# EAGLE design hc-cnc-pendant-2020 (EAGLE 9.5.2)
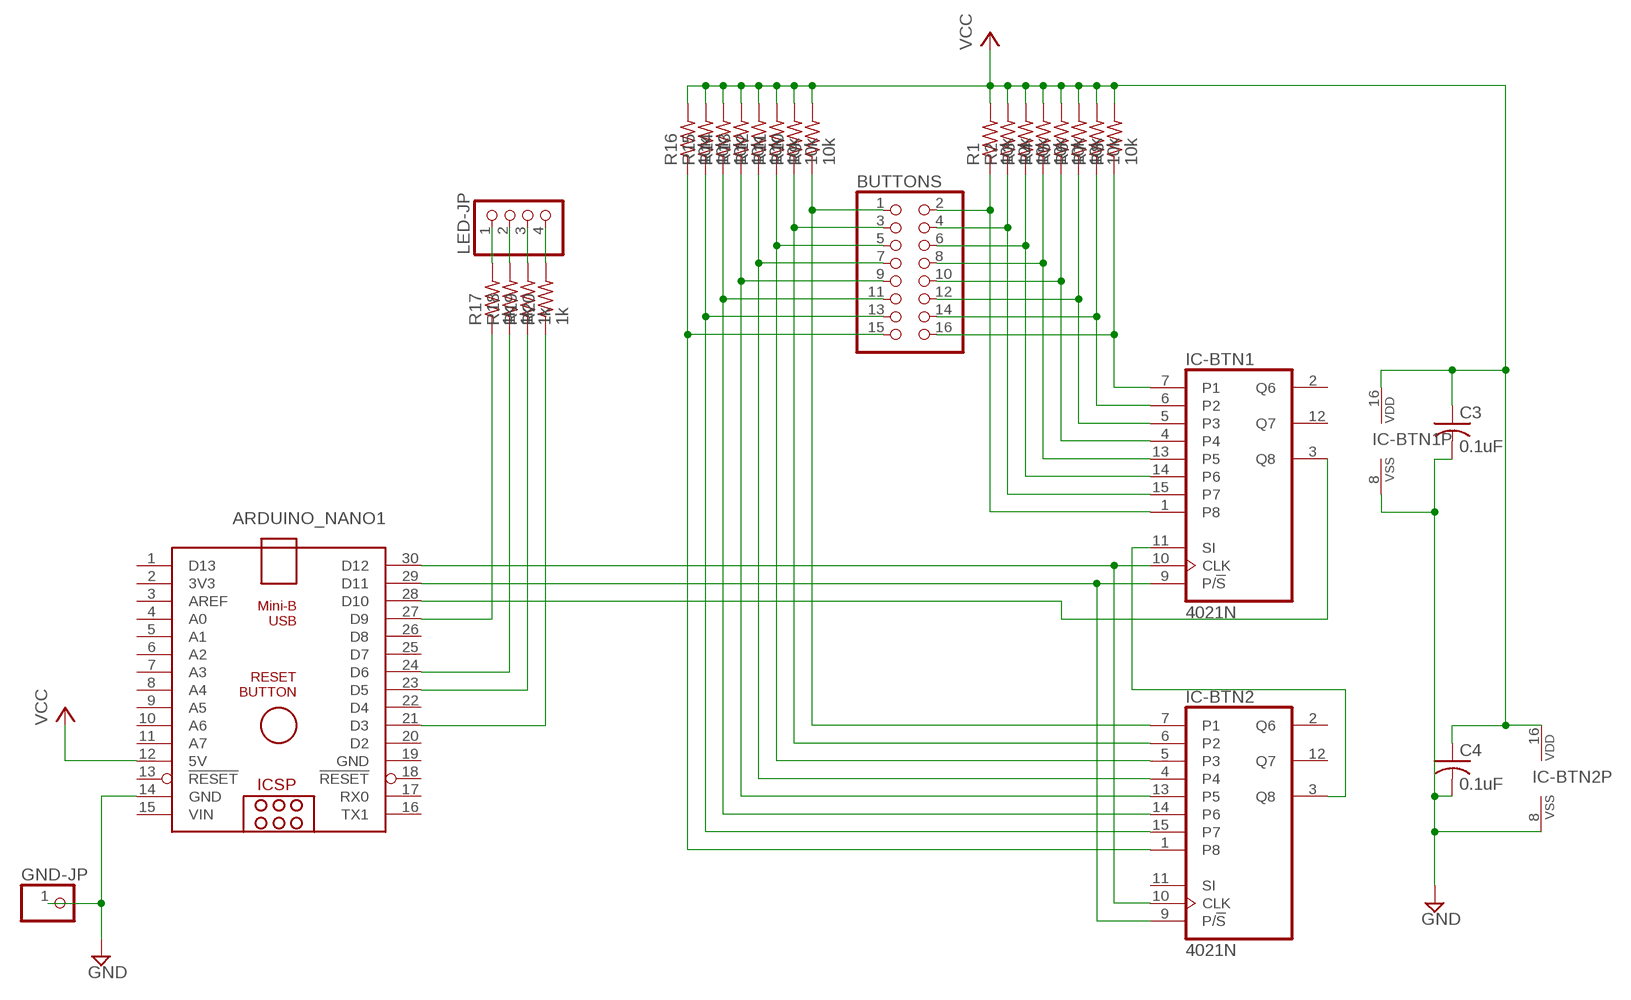
[diagram p0: schematic, sheet 1]

## Parts
ARDUINO_NANO1  ARDUINO_NANO_HCARDUINO_NANO_NO_HOLE  [ARDUINO_NANO_NO_HOLE]
BUTTONS  PINHD-2X8  [2X08]
C3  0.1uF  C-US025-030X050  [C025-030X050]
C4  0.1uF  C-US025-030X050  [C025-030X050]
GND-JP  PINHD-1X1  [1X01]
IC-BTN1  4021N  [DIL16]
IC-BTN2  4021N  [DIL16]
LED-JP  PINHD-1X4  [1X04]
R1  10k  R-US_0309/12  [0309/12]
R2  10k  R-US_0309/12  [0309/12]
R3  10k  R-US_0309/12  [0309/12]
R4  10k  R-US_0309/12  [0309/12]
R5  10k  R-US_0309/12  [0309/12]
R6  10k  R-US_0309/12  [0309/12]
R7  10k  R-US_0309/12  [0309/12]
R8  10k  R-US_0309/12  [0309/12]
R9  10k  R-US_0309/12  [0309/12]
R10  10k  R-US_0309/12  [0309/12]
R11  10k  R-US_0309/12  [0309/12]
R12  10k  R-US_0309/12  [0309/12]
R13  10k  R-US_0309/12  [0309/12]
R14  10k  R-US_0309/12  [0309/12]
R15  10k  R-US_0309/12  [0309/12]
R16  10k  R-US_0309/12  [0309/12]
R17  1k  R-US_0309/12  [0309/12]
R18  1k  R-US_0309/12  [0309/12]
R19  1k  R-US_0309/12  [0309/12]
R20  1k  R-US_0309/12  [0309/12]

## Nets
GND: ARDUINO_NANO1.14(GND) C3.2 C4.2 GND-JP.1 IC-BTN1.8(VSS) IC-BTN2.8(VSS)
N$1: ARDUINO_NANO1.30(D12) IC-BTN1.10(CLK) IC-BTN2.10(CLK)
N$2: ARDUINO_NANO1.29(D11) IC-BTN1.9(P/!S) IC-BTN2.9(P/!S)
N$3: BUTTONS.1 IC-BTN2.7(P1) R9.1
N$4: IC-BTN1.11(SI) IC-BTN2.3(Q8)
N$5: ARDUINO_NANO1.28(D10) IC-BTN1.3(Q8)
N$6: BUTTONS.3 IC-BTN2.6(P2) R10.1
N$7: BUTTONS.5 IC-BTN2.5(P3) R11.1
N$8: BUTTONS.7 IC-BTN2.4 R12.1
N$9: BUTTONS.9 IC-BTN2.13(P5) R13.1
N$10: BUTTONS.11 IC-BTN2.14(P6) R14.1
N$11: BUTTONS.13 IC-BTN2.15(P7) R15.1
N$12: BUTTONS.15 IC-BTN2.1(P8) R16.1
N$13: BUTTONS.2 IC-BTN1.1(P8) R1.1
N$14: BUTTONS.4 IC-BTN1.15(P7) R2.1
N$15: BUTTONS.6 IC-BTN1.14(P6) R3.1
N$16: BUTTONS.8 IC-BTN1.13(P5) R4.1
N$17: BUTTONS.10 IC-BTN1.4 R5.1
N$18: BUTTONS.12 IC-BTN1.5(P3) R6.1
N$19: BUTTONS.14 IC-BTN1.6(P2) R7.1
N$20: BUTTONS.16 IC-BTN1.7(P1) R8.1
N$21: LED-JP.1 R17.2
N$22: LED-JP.2 R18.2
N$23: LED-JP.3 R19.2
N$24: LED-JP.4 R20.2
N$25: ARDUINO_NANO1.21(D3) R20.1
N$26: ARDUINO_NANO1.23(D5) R19.1
N$27: ARDUINO_NANO1.24(D6) R18.1
N$28: ARDUINO_NANO1.27(D9) R17.1
VCC: ARDUINO_NANO1.12(5V) C3.1 C4.1 IC-BTN1.16(VDD) IC-BTN2.16(VDD) R1.2 R2.2 R3.2 R4.2 R5.2 R6.2 R7.2 R8.2 R9.2 R10.2 R11.2 R12.2 R13.2 R14.2 R15.2 R16.2
Unconnected: ARDUINO_NANO1.1(D13) ARDUINO_NANO1.2(3V3) ARDUINO_NANO1.3(AREF) ARDUINO_NANO1.4(A0) ARDUINO_NANO1.5(A1) ARDUINO_NANO1.6(A2) ARDUINO_NANO1.7(A3) ARDUINO_NANO1.8(A4) ARDUINO_NANO1.9(A5) ARDUINO_NANO1.10(A6) ARDUINO_NANO1.11(A7) ARDUINO_NANO1.13(!RESET) ARDUINO_NANO1.16(TX1) ARDUINO_NANO1.17(RX0) ARDUINO_NANO1.18(!RESET) ARDUINO_NANO1.20(D2) ARDUINO_NANO1.22(D4) ARDUINO_NANO1.25(D7) ARDUINO_NANO1.26(D8) IC-BTN1.2(Q6) IC-BTN1.12(Q7) IC-BTN2.2(Q6) IC-BTN2.11(SI) IC-BTN2.12(Q7)

## Power pins joined to a net without a drawn wire
GND: ARDUINO_NANO1.19(GND)
VIN: ARDUINO_NANO1.15(VIN)

## Library data of the parts
ARDUINO_NANO1 = ArduinoNano_HC:ARDUINO_NANO_HC: Arduino Nano HC Overview: The Arduino Nano is a small, complete, and breadboard-friendly board based on the ATmega328 (Arduino Nano 3.x) or ATmega168 (Arduino Nano 2.x). It has more or less the same functionality of the Arduino Duemilanove, but in a different package. It lacks only a DC power jack, and works with a Mini-B USB cable instead of a standard one. The Nano was designed and is being produced by Gravitech. Specifications: Microcontroller Atmel ATmega168 or ATmega328 Operating Voltage (logic level) 5 V Input Voltage (recommended) 7-12 V Input Voltage (limits) 6-20 V Digital I/O Pins 14 (of which 6 provide PWM output) Analog Input Pins 8 DC Current per I/O Pin 40 mA Flash Memory 16 KB (ATmega168) or 32 KB (ATmega328) of which 2 KB used by bootloader SRAM 1 KB (ATmega168) or 2 KB (ATmega328) EEPROM 512 bytes (ATmega168) or 1 KB (ATmega328) Clock Speed 16 MHz Dimensions 0.73" x 1.70" Length 45 mm Width 18 mm Weigth 5 g Power: The Arduino Nano can be powered via the Mini-B USB connection, 6-20V unregulated external power supply (pin 30), or 5V regulated external power supply (pin 27). The power source is automatically selected to the highest voltage source. Memory: The ATmega168 has 16 KB of flash memory for storing code (of which 2 KB is used for the bootloader); the ATmega328 has 32 KB, (also with 2 KB used for the bootloader). The ATmega168 has 1 KB of SRAM and 512 bytes of EEPROM (which can be read and written with the EEPROM library); the ATmega328 has 2 KB of SRAM and 1 KB of EEPROM. Input and Output: Each of the 14 digital pins on the Nano can be used as an input or output, using pinMode(), digitalWrite(), and digitalRead() functions. They operate at 5 volts. Each pin can provide or receive a maximum of 40 mA and has an internal pull-up resistor (disconnected by default) of 20-50 kOhms. In addition, some pins have specialized functions. Visit Arduino - ArduinoBoardNano <https://www.arduino.cc/en/Main/ArduinoBoardNano>
BUTTONS = pinhead:PINHD-2X8: PIN HEADER
C3 C4 = akstudios-adafruit:C-US: CAPACITOR, American symbol
GND-JP = pinhead:PINHD-1X1: PIN HEADER
IC-BTN1 IC-BTN2 = 40xx:4021: 8-bit static SHIFT REGISTER
LED-JP = pinhead:PINHD-1X4: PIN HEADER
R1-R20 = akstudios-adafruit:R-US_: RESISTOR, American symbol

## Board
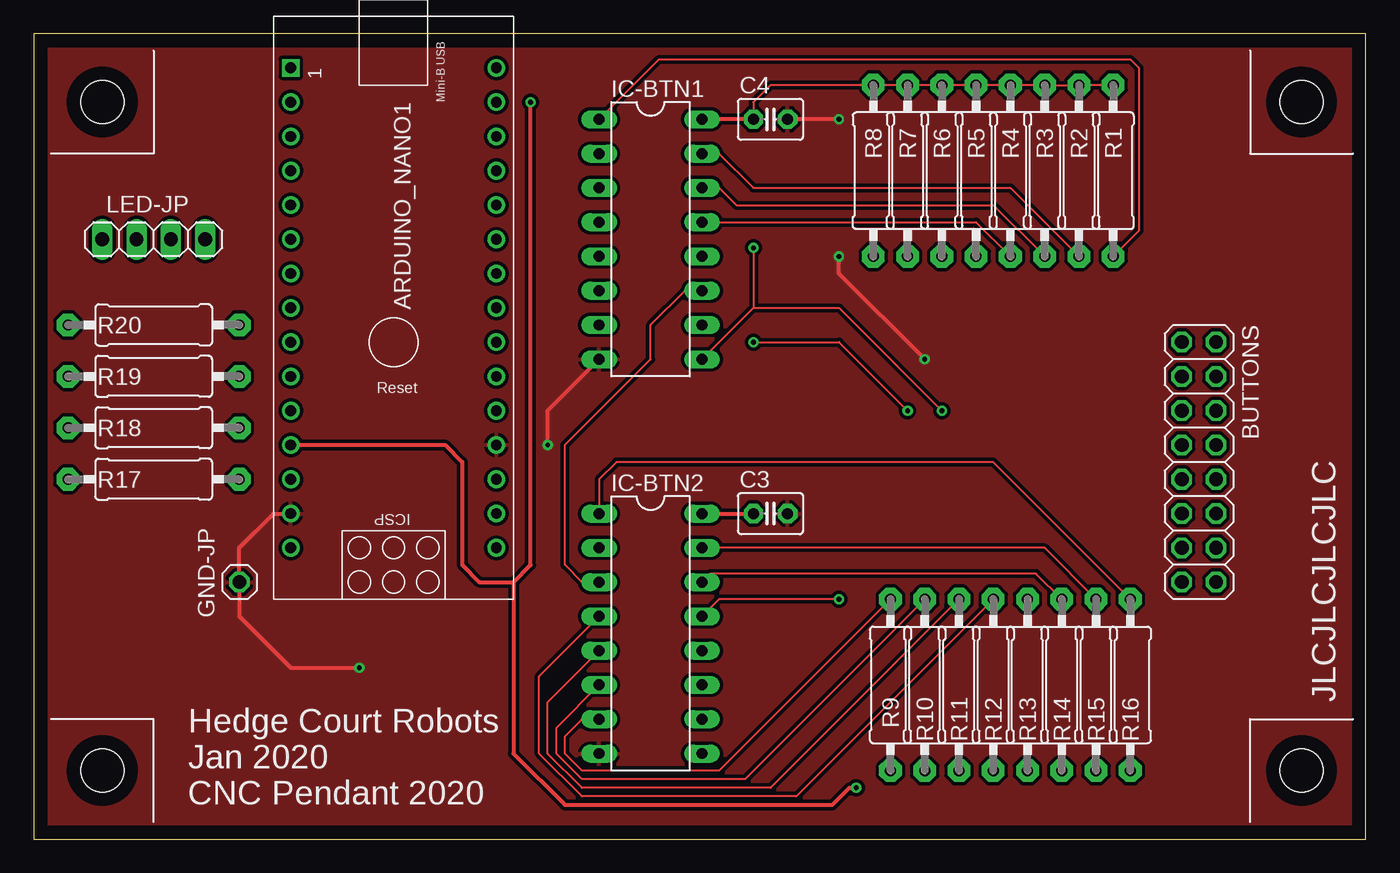
[diagram p1: board, top side]
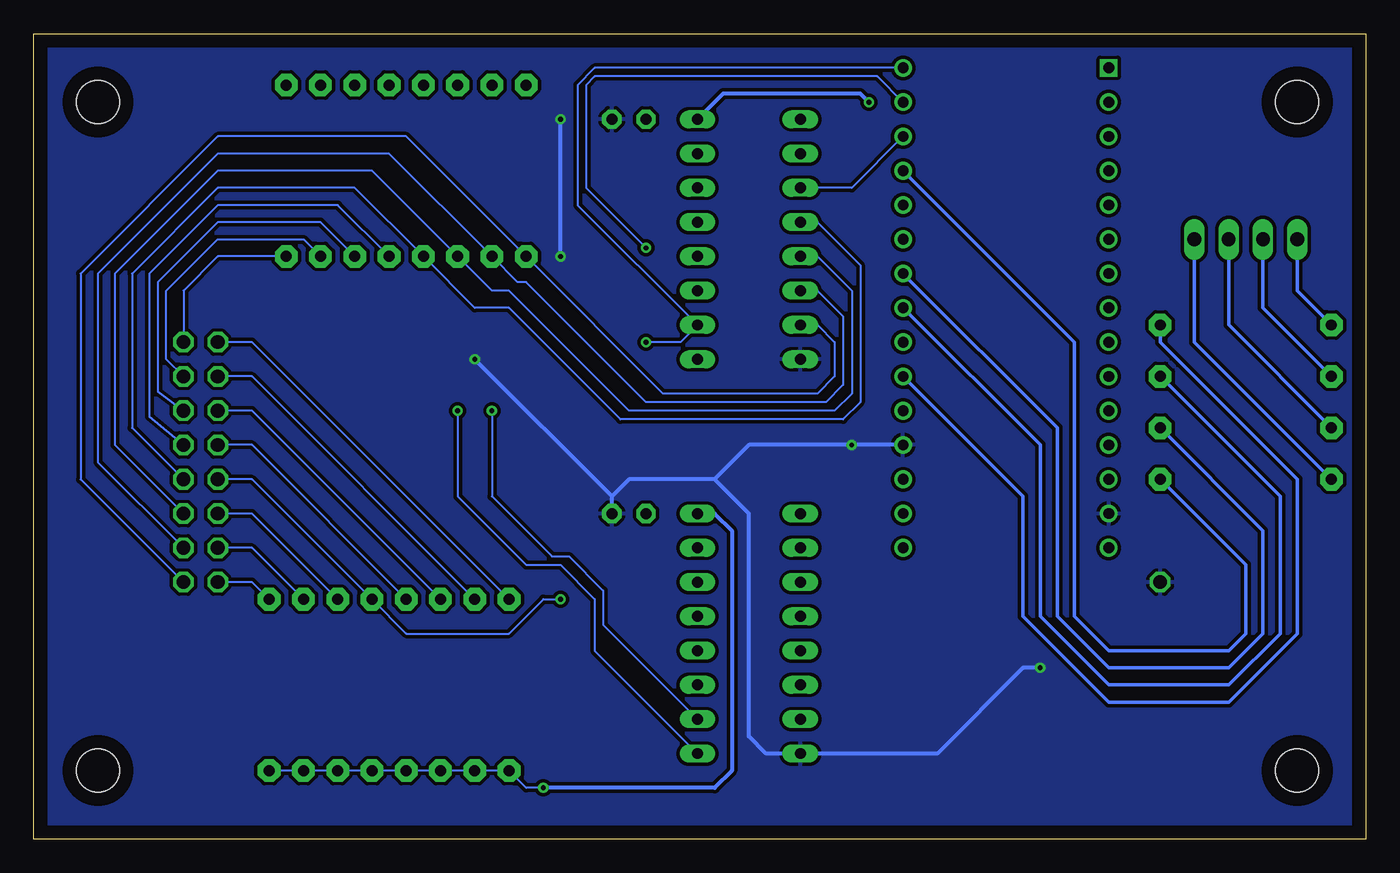
[diagram p2: board, bottom side, seen from below]

Size 98.73 x 59.68 mm. Coordinates in mm from the lower left corner, seen from the top.
Outline: 0,0 98.73,0 98.73,59.68 0,59.68 0,0
Copper layers (1*16): Top 0.035mm / dielectric 1.5mm / Bottom 0.035mm
Design rules "default": minimum track width 6mil, minimum drill 0.35mm, track to track 6mil, track to pad 6mil, pad to pad 6mil, via to via 6mil, smd to smd 6mil, copper to edge 40mil, drill to drill 6mil, minimum pad ring 10mil, minimum via ring 8mil, stop-mask expansion 4mil, vias tented up to drill 0mil, thermal gap 10mil
Holes 3.2 mm at 5.08,54.61 5.08,5.08 93.98,5.08 93.98,54.61

### Footprints (pad centres in the part's own frame; a part is rotated, then mirrored left to right if it is on the bottom)
ARDUINO_NANO_NO_HOLE = drill 0.8 square: 1 -20.32,-7.62 | drill 0.8: 2 -17.78,-7.62; 3 -15.24,-7.62; 4 -12.7,-7.62; 5 -10.16,-7.62; 6 -7.62,-7.62; 7 -5.08,-7.62; 8 -2.54,-7.62; 9 0,-7.62; 10 2.54,-7.62; 11 5.08,-7.62; 12 7.62,-7.62; 13 10.16,-7.62; 14 12.7,-7.62; 15 15.24,-7.62; 16 15.24,7.62; 17 12.7,7.62; 18 10.16,7.62; 19 7.62,7.62; 20 5.08,7.62; 21 2.54,7.62; 22 0,7.62; 23 -2.54,7.62; 24 -5.08,7.62; 25 -7.62,7.62; 26 -10.16,7.62; 27 -12.7,7.62; 28 -15.24,7.62; 29 -17.78,7.62; 30 -20.32,7.62
2X08 = drill 1.016 octagon: 1 -8.89,-1.27; 2 -8.89,1.27; 3 -6.35,-1.27; 4 -6.35,1.27; 5 -3.81,-1.27; 6 -3.81,1.27; 7 -1.27,-1.27; 8 -1.27,1.27; 9 1.27,-1.27; 10 1.27,1.27; 11 3.81,-1.27; 12 3.81,1.27; 13 6.35,-1.27; 14 6.35,1.27; 15 8.89,-1.27; 16 8.89,1.27
C025-030X050 = drill 0.813 pad 1.422 octagon: 1 -1.27,0; 2 1.27,0
1X01 = drill 1.016 octagon: 1 0,0
DIL16 = drill 0.813 long: 1 -8.89,-3.81; 2 -6.35,-3.81; 3 -3.81,-3.81; 4 -1.27,-3.81; 5 1.27,-3.81; 6 3.81,-3.81; 7 6.35,-3.81; 8 8.89,-3.81; 9 8.89,3.81; 10 6.35,3.81; 11 3.81,3.81; 12 1.27,3.81; 13 -1.27,3.81; 14 -3.81,3.81; 15 -6.35,3.81; 16 -8.89,3.81
1X04 = drill 1.016 long: 1 -3.81,0; 2 -1.27,0; 3 1.27,0; 4 3.81,0
0309/12 = drill 0.813 pad 1.676 octagon: 1 -6.35,0; 2 6.35,0

### Placement (x,y rotation side)
ARDUINO_NANO1  26.67,36.83 270 top
BUTTONS  86.36,27.94 270 top
C3  54.61,24.13 0 top
C4  54.61,53.34 0 top
GND-JP  15.24,19.05 0 top
IC-BTN1  45.72,44.45 270 top
IC-BTN2  45.72,15.24 270 top
LED-JP  8.89,44.45 180 top
R1  80.01,49.53 90 top
R2  77.47,49.53 90 top
R3  74.93,49.53 90 top
R4  72.39,49.53 90 top
R5  69.85,49.53 90 top
R6  67.31,49.53 90 top
R7  64.77,49.53 90 top
R8  62.23,49.53 90 top
R9  63.5,11.43 270 top
R10  66.04,11.43 270 top
R11  68.58,11.43 270 top
R12  71.12,11.43 270 top
R13  73.66,11.43 270 top
R14  76.2,11.43 270 top
R15  78.74,11.43 270 top
R16  81.28,11.43 270 top
R17  8.89,26.67 180 top
R18  8.89,30.48 180 top
R19  8.89,34.29 180 top
R20  8.89,38.1 180 top

### Tracks (layer width: path | path; a pad name or v marks a point on that pad's centre or on a via)
GND  (via drill 0.35)
  Top 0.305: ARDUINO_NANO1.14 17.78,24.13 15.24,21.59 GND-JP.1 15.24,16.51 19.05,12.7 v24.13,12.7 | v38.1,29.21 38.1,31.75 IC-BTN1.8 | v66.04,35.56 59.69,41.91 v59.69,43.18 | v59.69,53.34 C4.2
  Bottom 0.305: v24.13,12.7 25.4,12.7 31.75,6.35 IC-BTN2.8 44.45,6.35 45.72,7.62 45.72,24.13 48.26,26.67 | 55.88,25.4 54.61,26.67 48.26,26.67 | C3.2 55.88,25.4 | ARDUINO_NANO1.19 v38.1,29.21 45.72,29.21 48.26,26.67 | 55.88,25.4 v66.04,35.56 | v59.69,43.18 v59.69,53.34
  pour Top (isolate 0.254): 0,0 99.06,0 99.06,59.69 0,59.69
  pour Bottom (isolate 0.254): 0,0 99.06,0 99.06,59.69 0,59.69
N$1  (via drill 0.35)
  Top 0.152: v53.34,36.83 59.69,36.83 v64.77,31.75
  Bottom 0.152: ARDUINO_NANO1.30 57.15,57.15 58.42,55.88 58.42,46.99 IC-BTN1.10 50.8,36.83 v53.34,36.83 | v64.77,31.75 64.77,25.4 60.33,20.95 59.05,20.95 56.52,18.41 56.52,15.88 IC-BTN2.10
N$2  (via drill 0.35)
  Top 0.152: v53.34,43.81 53.34,39.37 | IC-BTN1.9 53.34,39.37 | 53.34,39.37 59.69,39.37 v67.31,31.75
  Bottom 0.152: ARDUINO_NANO1.29 36.2,56.52 57.15,56.52 57.78,55.88 57.78,48.26 v53.34,43.81 | v67.31,31.75 67.31,25.4 62.23,20.32 59.69,20.32 57.15,17.78 57.15,13.97 IC-BTN2.9
N$3
  Top 0.152: R9.1 50.8,5.08 40.64,5.08 39.37,6.35 39.37,7.62 40.64,8.89 IC-BTN2.7
  Bottom 0.152: R9.1 82.55,36.83 BUTTONS.1
N$4
  Top 0.152: IC-BTN2.3 40.64,19.05 39.37,20.32 39.37,29.21 45.72,35.56 45.72,38.1 48.26,40.64 IC-BTN1.11
N$5
  Bottom 0.152: ARDUINO_NANO1.28 38.1,48.26 IC-BTN1.3
N$6
  Top 0.152: R10.1 52.7,4.45 40.64,4.45 38.73,6.35 38.73,8.26 IC-BTN2.6
  Bottom 0.152: R10.1 82.55,34.29 BUTTONS.3
N$7
  Top 0.152: R11.1 54.61,3.81 40.64,3.81 38.1,6.35 38.1,10.16 IC-BTN2.5
  Bottom 0.152: R11.1 82.55,31.75 BUTTONS.5
N$8
  Top 0.152: R12.1 56.52,3.17 40.64,3.17 37.47,6.35 37.47,12.06 IC-BTN2.4
  Bottom 0.152: R12.1 82.55,29.21 BUTTONS.7
N$9  (via drill 0.35)
  Top 0.152: v59.69,17.78 50.8,17.78 IC-BTN2.13
  Bottom 0.152: BUTTONS.9 82.55,26.67 R13.1 71.12,15.24 63.5,15.24 60.96,17.78 v59.69,17.78
N$10
  Top 0.152: R14.1 74.3,19.68 50.16,19.68 IC-BTN2.14
  Bottom 0.152: R14.1 82.55,24.13 BUTTONS.11
N$11
  Top 0.152: R15.1 74.93,21.59 IC-BTN2.15
  Bottom 0.152: R15.1 82.55,21.59 BUTTONS.13
N$12
  Top 0.152: R16.1 71.12,27.94 43.18,27.94 41.91,26.67 IC-BTN2.1
  Bottom 0.152: R16.1 82.55,19.05 BUTTONS.15
N$13
  Top 0.152: R1.1 81.92,45.09 81.92,57.15 81.28,57.78 46.35,57.78 IC-BTN1.1
  Bottom 0.152: R1.1 85.09,43.18 87.63,40.64 BUTTONS.2
N$14
  Top 0.152: IC-BTN1.15 50.8,50.8 53.34,48.26 72.39,48.26 R2.1
  Bottom 0.152: R2.1 78.74,44.45 85.09,44.45 88.9,40.64 88.9,35.56 BUTTONS.4
N$15
  Top 0.152: IC-BTN1.14 50.8,48.26 52.07,46.99 71.12,46.99 R3.1
  Bottom 0.152: R3.1 77.47,45.72 85.09,45.72 89.53,41.27 89.53,33.18 BUTTONS.6
N$16
  Top 0.152: IC-BTN1.13 69.85,45.72 R4.1
  Bottom 0.152: R4.1 76.2,46.99 85.09,46.99 90.17,41.91 90.17,31.33 BUTTONS.8
N$17
  Bottom 0.152: BUTTONS.10 91.44,30.48 91.44,41.91 85.09,48.26 74.93,48.26 R5.1 66.04,39.37 63.5,39.37 55.24,31.11 38.73,31.11 37.47,32.38 37.47,42.55 40.64,45.72 IC-BTN1.4
N$18
  Bottom 0.152: BUTTONS.12 92.71,29.21 92.71,41.91 85.09,49.53 73.66,49.53 R6.1 64.77,40.64 63.5,40.64 54.61,31.75 39.37,31.75 38.1,33.02 38.1,40.64 40.64,43.18 IC-BTN1.5
N$19
  Bottom 0.152: BUTTONS.14 93.98,27.94 93.98,41.91 85.09,50.8 72.39,50.8 R7.1 62.87,41.27 62.23,41.27 53.34,32.38 40.01,32.38 38.73,33.66 38.73,38.73 40.64,40.64 IC-BTN1.6
N$20
  Bottom 0.152: BUTTONS.16 95.25,26.67 95.25,41.91 85.09,52.07 71.12,52.07 R8.1 52.07,33.02 40.64,33.02 39.37,34.29 39.37,36.83 40.64,38.1 IC-BTN1.7
N$21
  Bottom 0.254: R17.2 12.7,36.83 LED-JP.1
N$22
  Bottom 0.254: R18.2 10.16,38.1 LED-JP.2
N$23
  Bottom 0.254: R19.2 7.62,39.37 LED-JP.3
N$24
  Bottom 0.254: R20.2 5.08,40.64 LED-JP.4
N$25
  Bottom 0.254: ARDUINO_NANO1.21 25.4,25.4 25.4,16.51 19.05,10.16 10.16,10.16 5.08,15.24 5.08,26.67 15.24,36.83 R20.1
N$26
  Bottom 0.254: ARDUINO_NANO1.23 24.13,29.21 24.13,16.51 19.05,11.43 10.16,11.43 6.35,15.24 6.35,25.4 R19.1
N$27
  Bottom 0.254: ARDUINO_NANO1.24 22.86,30.48 22.86,16.51 19.05,12.7 10.16,12.7 7.62,15.24 7.62,22.86 R18.1
N$28
  Bottom 0.254: ARDUINO_NANO1.27 21.59,36.83 21.59,16.51 19.05,13.97 10.16,13.97 8.89,15.24 8.89,20.32 R17.1
VCC  (via drill 0.35)
  Top 0.152: R1.2 R2.2 R3.2 R4.2 R5.2 R6.2 R7.2 R8.2 54.61,55.88 53.34,54.61 C4.1
  Top 0.305: C4.1 IC-BTN1.16 | ARDUINO_NANO1.12 30.48,29.21 31.75,27.94 31.75,20.32 33.02,19.05 35.56,19.05 | 35.56,19.05 36.83,20.32 v36.83,54.61 | IC-BTN2.16 C3.1 | 35.56,19.05 35.56,6.35 39.37,2.54 59.18,2.54 60.45,3.81 v60.96,3.81
  Bottom 0.152: v60.96,3.81 62.23,3.81 R9.2 R10.2 R11.2 R12.2 R13.2 R14.2 R15.2 R16.2
  Bottom 0.305: v36.83,54.61 37.47,55.24 47.62,55.24 IC-BTN1.16 | IC-BTN2.16 48.26,24.13 46.99,22.86 46.99,5.08 48.26,3.81 v60.96,3.81

### Text on the board
tPlace: JLCJLCJLCJLC | Hedge Court Robots / Jan 2020 / CNC Pendant 2020